# Altium schematic sheet Zigbee interface.SchDoc: Xbee with dedicated PSU
size A4; Organization: Altium Limited; Address1: 3 Minna Close; Address2: Belrose; Address3: NSW 2085; Address4: Australia
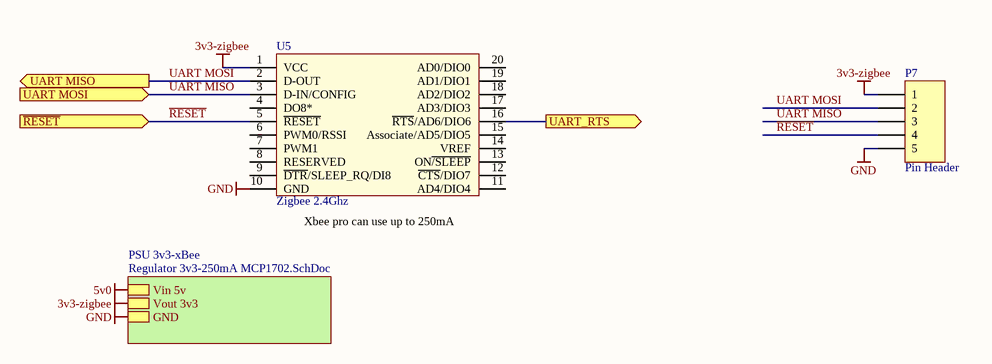
[diagram p0: Zigbee interface.SchDoc]

## Parts
P7  Pin Header  [PH1x5_2.54]
U5  Zigbee 2.4Ghz  [Zigbee_maxstream]

## Sub-sheets
PSU 3v3-xBee = Regulator 3v3-250mA MCP1702.SchDoc: Vin 5v, Vout 3v3, GND

## Ports
UART MISO (out), UART MOSI (in), UART_RTS (out), ~{RESET} (in)

## Nets
3v3-zigbee: P7.1 U5.1(VCC) ; sheet PSU 3v3-xBee/Vout 3v3
5v0: sheet PSU 3v3-xBee/Vin 5v
GND: P7.5 U5.10(GND) ; sheet PSU 3v3-xBee/GND
~{RESET}: P7.4 U5.5(~{RESET}) ; port ~{RESET}
UART MISO: P7.3 U5.3(D-IN/CONFIG) ; port UART MOSI
UART MOSI: P7.2 U5.2(D-OUT) ; port UART MISO
UART_RTS: U5.16(~{RTS}/AD6/DIO6) ; port UART_RTS

Not connected (* = marked no-connect by the designer): U5 4(DO8*) 6(PWM0/RSSI) 7(PWM1) 8(RESERVED) 9(~{DTR}/SLEEP_RQ/DI8) 11(AD4/DIO4) 12(~{CTS}/DIO7) 13(ON~{/SLEEP}) 14(VREF) 15(Associate/AD5/DIO5) 17(AD3/DIO3) 18(AD2/DIO2) 19(AD1/DIO1) 20(AD0/DIO0)

## Notes on the sheet
- (near U5) Xbee pro can use up to 250mA
- Disclaimer
  Any design and information, hardware or software  is provided on an "as-is" basis without warranty of any kind and any express or implied warranties, including, but not limited to, the implied warranties of merchantability and fitness for a particular purpose are disclaimed. In no event shall wnpd (or KeaDrone)be liable for any direct, indirect, incidental, special, exemplary, or consequential damages (including, but not limited to, procurement of substitute goods or services; loss of use, data, or profits; or business interruption) however caused and on any theory of liability, whether in contract, strict liability, or tort (including negligence or otherwise) arising in any way out of the use of this firmware, hardware, software or information, even if wnpd (or KeaDrone) has been advised by user of the possibility of such potential loss or damage. The user agrees to hold wnpd (or KeaDrone) harmless from and against any and all claims, losses, liabilities and expenses.
- Title
- Size:
- Date:
- A4
- Name:
- Time:
- Ing. W. Pietersz
- Revision:
- Sheet
- of
- WillyPietersz@gmail.com
- Contact:
- -
- www.wnpd.nl
- File:

## Library data of the parts
P7 = PH1x5: Con1x5; Part Number: PH1x5; Pitch: 2.54; LatestRevision Note: Initial Release; Type: Pin Header; Number Of Pins: 5; Component Type: Standard; LatestRevision Date: 23-11-2010; Author: Willy Pietersz; Supplier 2: Farnell
U5 = Zigbee-WRL-08690: Wireless, zigbee module from Maxstream;; Part Number: Zigbee-WRL-08690; Component Type: Wireless, Zigbee; ComponentLink1Description: Datasheet; ComponentLink1URL: http://www.sparkfun.com/datasheets/Wireless/Zigbee/XBee-Datasheet.pdf